# Altium schematic sheet VGA.SchDoc
size A; DocumentNumber: 5; SheetNumber: 5; SheetTotal: 8
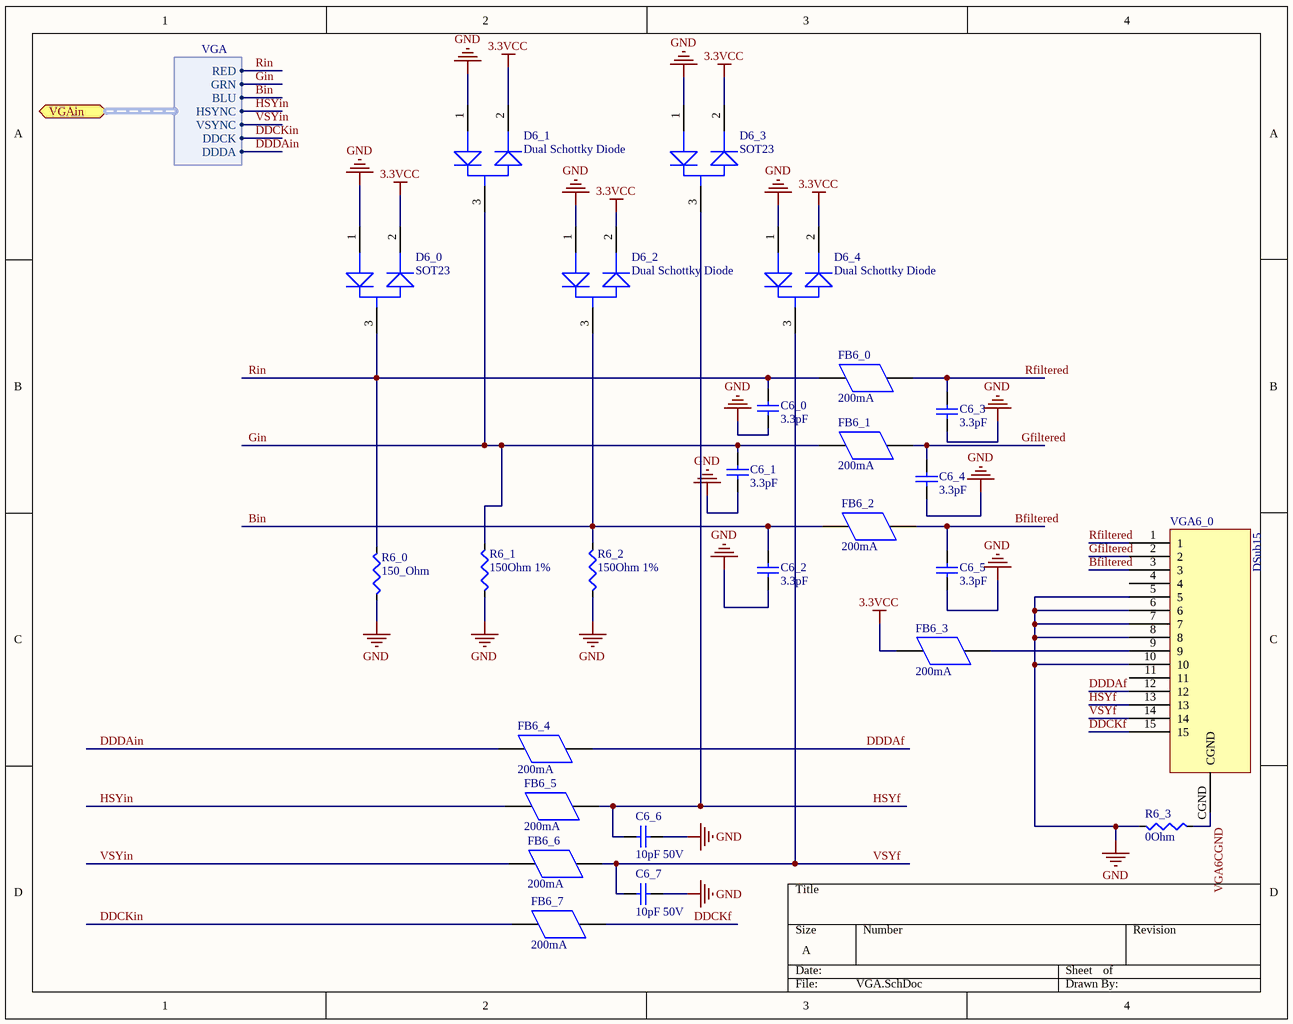
[diagram p0: VGA.SchDoc]

## Parts
C6_0  3.3pF  [0805 (2012) Capacitor]
C6_1  3.3pF  [0805 (2012) Capacitor]
C6_2  3.3pF  [0805 (2012) Capacitor]
C6_3  3.3pF  [0805 (2012) Capacitor]
C6_4  3.3pF  [0805 (2012) Capacitor]
C6_5  3.3pF  [0805 (2012) Capacitor]
C6_6  10pF 50V  [0805 (2012) Capacitor]
C6_7  10pF 50V  [0805 (2012) Capacitor]
D6_0  SOT23  [SOT23]
D6_1  Dual Schottky Diode  [SOT23]
D6_2  Dual Schottky Diode  [SOT23]
D6_3  SOT23  [SOT23]
D6_4  Dual Schottky Diode  [SOT23]
FB6_0  200mA  [0805 (2012) Capacitor]
FB6_1  200mA  [0805 (2012) Capacitor]
FB6_2  200mA  [0805 (2012) Capacitor]
FB6_3  200mA  [0805 (2012) Capacitor]
FB6_4  200mA  [0805 (2012) Capacitor]
FB6_5  200mA  [0805 (2012) Capacitor]
FB6_6  200mA  [0805 (2012) Capacitor]
FB6_7  200mA  [0805 (2012) Capacitor]
R6_0  150_Ohm  [R 0805 (2012) RESISTOR]
R6_1  150Ohm 1%  [R 0805 (2012) RESISTOR]
R6_2  150Ohm 1%  [R 0805 (2012) RESISTOR]
R6_3  0Ohm  [R 1210 (3225) RESISTOR]
VGA6_0  DSub15  [DSub15]

## Ports
VGAin (harness VGA)

## Harnesses
VGA: RED, GRN, BLU, HSYNC, VSYNC, DDCK, DDDA

## Nets
3.3VCC: D6_0.2 D6_1.2 D6_2.2 D6_3.2 D6_4.2 FB6_3.1
GND: C6_0.2 C6_1.2 C6_2.2 C6_3.2 C6_4.2 C6_5.2 C6_6.1 C6_7.1 D6_0.1 D6_1.1 D6_2.1 D6_3.1 D6_4.1 R6_0.1 R6_1.1 R6_2.1 R6_3.1 VGA6_0.5 VGA6_0.6 VGA6_0.7 VGA6_0.8 VGA6_0.10
Bfiltered: C6_5.1 FB6_2.2 VGA6_0.3
Bin: C6_2.1 D6_2.3 FB6_2.1 R6_2.2 ; port VGAin.BLU
DDCKf: FB6_7.2 VGA6_0.15
DDCKin: FB6_7.1 ; port VGAin.DDCK
DDDAf: FB6_4.2 VGA6_0.12
DDDAin: FB6_4.1 ; port VGAin.DDDA
Gfiltered: C6_4.1 FB6_1.2 VGA6_0.2
Gin: C6_1.1 D6_1.3 FB6_1.1 R6_1.2 ; port VGAin.GRN
HSYf: C6_6.2 D6_3.3 FB6_5.2 VGA6_0.13
HSYin: FB6_5.1 ; port VGAin.HSYNC
Rfiltered: C6_3.1 FB6_0.2 VGA6_0.1
Rin: C6_0.1 D6_0.3 FB6_0.1 R6_0.2 ; port VGAin.RED
VGA6CGND: R6_3.2 VGA6_0.CGND
VSYf: C6_7.2 D6_4.3 FB6_6.2 VGA6_0.14
VSYin: FB6_6.1 ; port VGAin.VSYNC
NetFB6_3_2: FB6_3.2 VGA6_0.9

Not connected (* = marked no-connect by the designer): VGA6_0 4 11

## Library data of the parts
C6_0-C6_7 = Capacitor (non-polarized): Capacitor; Value: .1uF
D6_0 D6_3 = Dual Schottky Diode
FB6_0-FB6_7 = Ferrite Beads
R6_0 = Resistor: Value: 150Ohm 1%; Digikey Part Number: RHM150CRCT-ND
R6_1-R6_3 = Resistor
  R6_1 R6_2: Value: 150Ohm 1%; Digikey Part Number: RHM150CRCT-ND
  R6_3: Value: 0Ohm
VGA6_0 = DSub15: DSub15 Connector Tyco PN 1734344